# Altium schematic sheet MCU.SchDoc
size A4; SheetNumber: 2; SheetTotal: 6
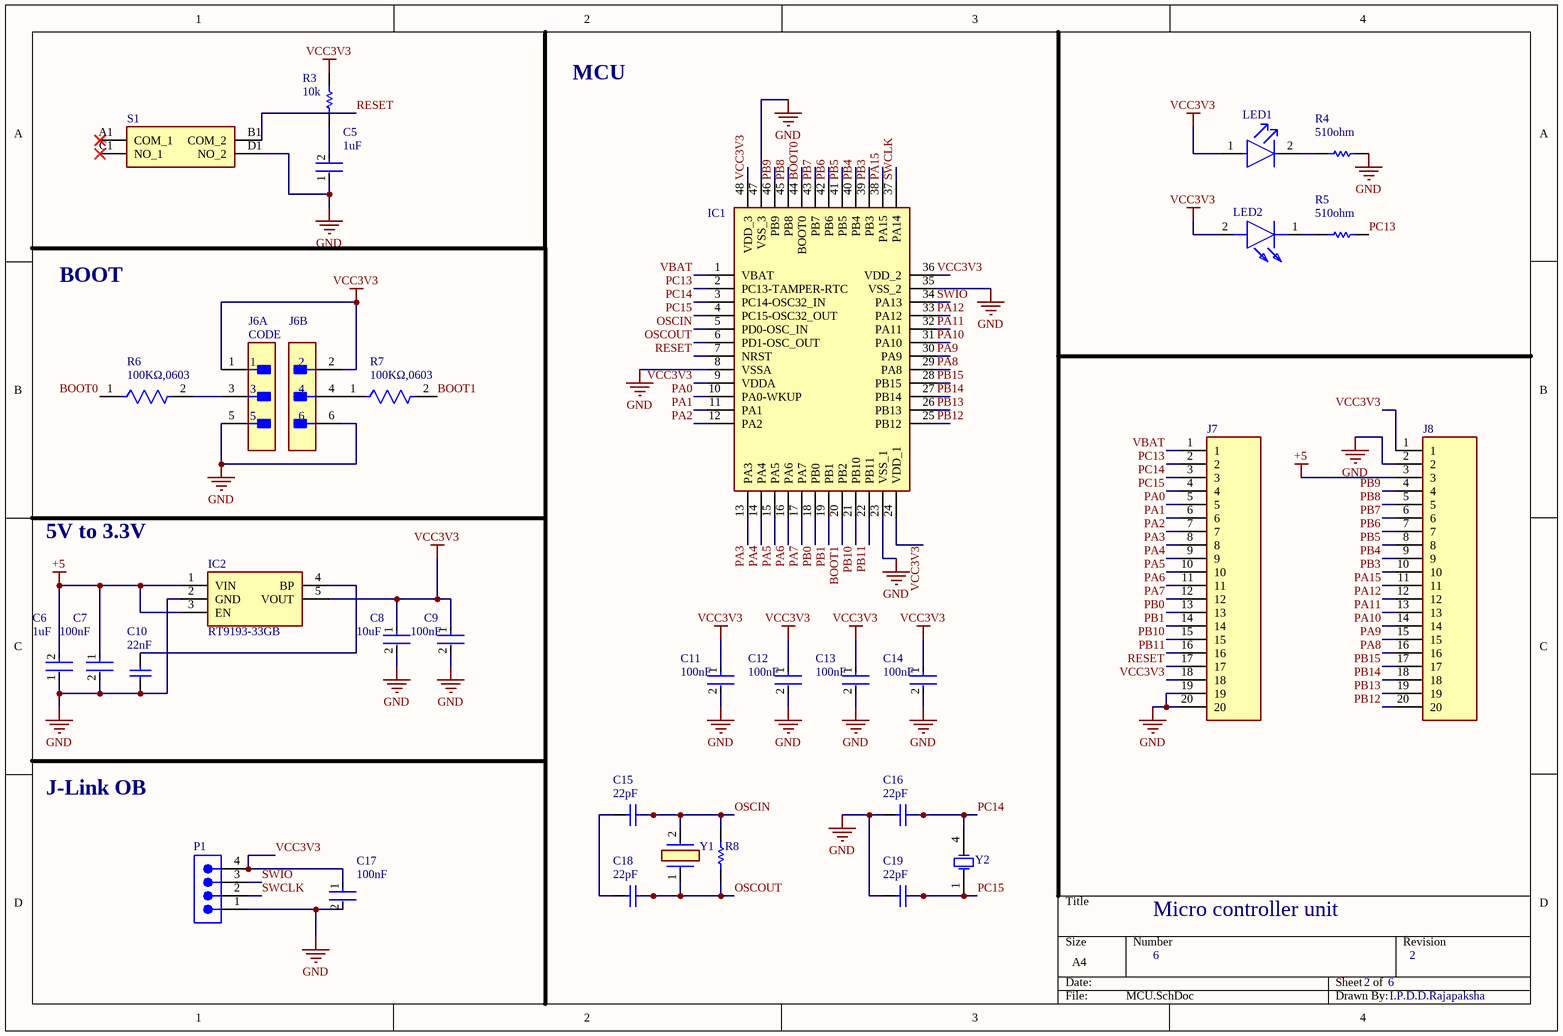
[diagram p0: MCU.SchDoc]

## Parts
C5  Capacitance: 1uF  [FP-C1608-080-0_1-IPC_A]  (hidden comment: C1608X6S1H105K080AC)
C6  Capacitance: 1uF  [FP-C1608-080-0_1-IPC_A]  (hidden comment: C1608X6S1H105K080AC)
C7  Capacitance: 100nF  [FP-C0603-030-0_03-IPC_C]  (hidden comment: C0603X5R1E104K030BB)
C8  value 10uF  [FP-CL05A106MP5NUNC-MFG]  (hidden comment: CL05A106MP5NUNC)
C9  Capacitance: 100nF  [FP-C0603-030-0_03-IPC_C]  (hidden comment: C0603X5R1E104K030BB)
C10  Parameter 1: 22nF  [CAPC1608X87X35ML15T15]  (hidden comment: C0603S223K5RACTU)
C11  Capacitance: 100nF  [FP-C0603-030-0_03-IPC_C]  (hidden comment: C0603X5R1E104K030BB)
C12  Capacitance: 100nF  [FP-C0603-030-0_03-IPC_C]  (hidden comment: C0603X5R1E104K030BB)
C13  Capacitance: 100nF  [FP-C0603-030-0_03-IPC_C]  (hidden comment: C0603X5R1E104K030BB)
C14  Capacitance: 100nF  [FP-C0603-030-0_03-IPC_C]  (hidden comment: C0603X5R1E104K030BB)
C15  Capacitance: 22pF  [CAPC1005X55X25ML05T05]  (hidden comment: CC0402JRNPO9BN220)
C16  Capacitance: 22pF  [CAPC1005X55X25ML05T05]  (hidden comment: CC0402JRNPO9BN220)
C17  Capacitance: 100nF  [FP-C0603-030-0_03-IPC_C]  (hidden comment: C0603X5R1E104K030BB)
C18  Capacitance: 22pF  [CAPC1005X55X25ML05T05]  (hidden comment: CC0402JRNPO9BN220)
C19  Capacitance: 22pF  [CAPC1005X55X25ML05T05]  (hidden comment: CC0402JRNPO9BN220)
IC1  STM32F103C8T6XXX  [QFP50P900X900X160-48N]  (value not drawn)
IC2  RT9193-33GB  [SOT94P279X130-5N]
J6  Parameter 1: CODE  [FP-90131-0763-MFG]  (hidden comment: 90131-0763)  (parts A,B of 2)
J7  TS-120-G-A-1  [HDRV20W64P0X254_1X20_5080X254X808P]  (value not drawn)
J8  TS-120-G-A-1  [HDRV20W64P0X254_1X20_5080X254X808P]  (value not drawn)
LED1  SM0805UBWC  [FP-SM0805UBWC-MFG]  (value not drawn)
LED2  SM0805RC  [LEDC2012X110N]  (value not drawn)
P1  61300411021  [61300411021]  (value not drawn)
R3  Parameter 1: 10k  [RESC1005X35X20ML05T10]  (hidden comment: CPF0402B30KE1)
R4  Parameter 1: 510ohm  [RESC1609X50X30NL10T20]  (hidden comment: CRCW0603510RFKEA)
R5  Parameter 1: 510ohm  [RESC1609X50X30NL10T20]  (hidden comment: CRCW0603510RFKEA)
R6  value 100KΩ,0603  [FP-SR0603-MFG]  (hidden comment: SR0603FR-7T100KL)
R7  value 100KΩ,0603  [FP-SR0603-MFG]  (hidden comment: SR0603FR-7T100KL)
R8  RK73B2ATTD105J  [RESC2013X60X30NL20T20]  (value not drawn)
S1  TS-1187A-B-A-B  [TS1187ABAB]  (value not drawn)
Y1  XT9S20ANA8M  [XT9S20ANA8M]  (value not drawn)
Y2  830003000  [WE-XTAL_85SMX]  (value not drawn)

## Nets
+5: C6.2 C7.1 IC2.1(VIN) IC2.3(EN) J8.3
GND: C5.1 C6.1 C7.2 C8.2 C9.2 C10.1 C11.2 C12.2 C13.2 C14.2 C16.1 C17.2 C19.1 IC1.8(VSSA) IC1.23(VSS_1) IC1.35(VSS_2) IC1.47(VSS_3) IC2.2(GND) J6.5 J6.6 J7.19 J7.20 J8.2 P1.1 R4.2 S1.D1(NO_2)
VCC3V3: C8.1 C9.1 C11.1 C12.1 C13.1 C14.1 C17.1 IC1.9(VDDA) IC1.24(VDD_1) IC1.36(VDD_2) IC1.48(VDD_3) IC2.5(VOUT) J6.1 J6.2 J7.18 J8.1 LED1.1(A) LED2.2(A) P1.4 R3.2
BOOT0: IC1.44(BOOT0) R6.1
BOOT1: IC1.20(PB2) R7.2
OSCIN: C15.2 IC1.5(PD0-OSC_IN) R8.2 Y1.2
OSCOUT: C18.2 IC1.6(PD1-OSC_OUT) R8.1 Y1.1
PA0: IC1.10(PA0-WKUP) J7.5
PA1: IC1.11(PA1) J7.6
PA2: IC1.12(PA2) J7.7
PA3: IC1.13(PA3) J7.8
PA4: IC1.14(PA4) J7.9
PA5: IC1.15(PA5) J7.10
PA6: IC1.16(PA6) J7.11
PA7: IC1.17(PA7) J7.12
PA8: IC1.29(PA8) J8.16
PA9: IC1.30(PA9) J8.15
PA10: IC1.31(PA10) J8.14
PA11: IC1.32(PA11) J8.13
PA12: IC1.33(PA12) J8.12
PA15: IC1.38(PA15) J8.11
PB0: IC1.18(PB0) J7.13
PB1: IC1.19(PB1) J7.14
PB3: IC1.39(PB3) J8.10
PB4: IC1.40(PB4) J8.9
PB5: IC1.41(PB5) J8.8
PB6: IC1.42(PB6) J8.7
PB7: IC1.43(PB7) J8.6
PB8: IC1.45(PB8) J8.5
PB9: IC1.46(PB9) J8.4
PB10: IC1.21(PB10) J7.15
PB11: IC1.22(PB11) J7.16
PB12: IC1.25(PB12) J8.20
PB13: IC1.26(PB13) J8.19
PB14: IC1.27(PB14) J8.18
PB15: IC1.28(PB15) J8.17
PC13: IC1.2(PC13-TAMPER-RTC) J7.2 R5.2
PC14: C16.2 IC1.3(PC14-OSC32_IN) J7.3 Y2.4(Crystal)
PC15: C19.2 IC1.4(PC15-OSC32_OUT) J7.4 Y2.1(Crystal)
RESET: IC1.7(NRST) J7.17 S1.B1(COM_2)
SWCLK: IC1.37(PA14) P1.2
SWIO: IC1.34(PA13) P1.3
VBAT: IC1.1(VBAT) J7.1
NetC5_2: C5.2 R3.1
NetC10_2: C10.2 IC2.4(BP)
NetC15_1: C15.1 C18.1
NetJ6_3: J6.3 R6.2
NetJ6_4: J6.4 R7.1
NetLED1_2: LED1.2(C) R4.1
NetLED2_1: LED2.1(K) R5.1

Not connected (* = marked no-connect by the designer): S1 A1(COM_1)* C1(NO_1)*

## Notes on the sheet
- MCU
- BOOT
- 5V to 3.3V
- J-Link OB
- Micro controller unit
- 6
- 2      6
- 2
- I.P.D.D.Rajapaksha

## Library data of the parts
C5 C6 = CMP-08246-003682-1: Multilayer Ceramic Capacitors 1μF ±10% 50V X6S SMD 0603; Dielectric: X6S; Series: C; Construction: Flat; REACH SVHC: No SVHC; Voltage Rating (DC): 50V; Dielectric Material: Ceramic; Weight: 7.1E-05oz; Case Code (Imperial): 0603; Width: 0.031inch; Voltage Rating: 50V; Min Operating Temperature: -55°C; Thickness: 0.035inch; Package Quantity: 4000; RoHS Compliant: Yes; Case/Package: 0603; Case Code (Metric): 1608; Packaging: Tape and Reel; Termination: SMD/SMT; Depth: 0.8mm; Tolerance: 10%; Height: 0.8mm; Max Operating Temperature: 105°C; Length: 1.6mm; Mount: Surface Mount; Lead Free: Lead Free
C7 C9 C11-C14 C17 = CMP-08246-005139-1: Multilayer Ceramic Capacitors 100nF ±10% 25V X5R SMD 0201; Min Operating Temperature: -55°C; Tolerance: 10%; Height: 0.3mm; Lead Free: Lead Free; Width: 0.012inch; Dielectric Material: Ceramic; Voltage Rating (DC): 25V; Voltage Rating: 25V; Thickness: 0.013inch; Depth: 0.3mm; Case Code (Imperial): 0201; Max Operating Temperature: 85°C; Case/Package: 0201; Series: C; RoHS Compliant: Yes; Packaging: Tape and Reel; Weight: 6E-06oz; Dielectric: X5R; Length: 0.6mm; Mount: Surface Mount; Case Code (Metric): 0603; Termination: SMD/SMT; REACH SVHC: No SVHC; Package Quantity: 15000
C8 = CMP-13271-000002-1: CAP CER 10UF 10V X5R 0402; Manufacturer: Samsung; Temperature Coefficient: 15%; Tolerance: 20%; Material: Ceramic; Octopart: https://octopart.com/cl05a106mp5nunc-samsung-22457395; Voltage Rating: 10V; RoHS: TRUE; Height: 0.7mm; Digikey Description: CAP CER 10UF 10V X5R 0402; Automotive: No; Package: CL05A106MP5NUNC; Device Class L1: Passive Components; Capacitance: 10uF; Temperature Range High: +85°C; ComponentLink2Description: Datasheet; Device Class L2: Capacitors; Temperature Characteristic: X5R; Manufacturer Part Number: CL05A106MP5NUNC; Temperature: -55°C to +85°C; ComponentLink2URL: http://www.samsungsem.com/kr/support/product-search/mlcc/__icsFiles/afieldfile/2019/05/10/19-CL05A106MP5NUNC.pdf; Device Class L3: Ceramic Capacitors; Category: Cap; Temperature Range Low: -55°C; Ipc Land Pattern Name: CAPC10050X50; Lead Free: Yes
C10 = CMP-2006-03290-1: Manufacturer: Kemet; Part Number: C0603S223K5RACTU
C15 C16 C18 C19 = CMP-2100-03590-1: Chip Capacitor, 22 pF, +/- 5%, 50 V, -55 to 125 degC, 0402 (1005 Metric), RoHS, Tape and Reel; Manufacturer: Yageo; Voltage Rating: 50V; Dielectric Material: Ceramic; Temperature Coefficient: 30ppm/degC; Dielectric: C0G; Insulation Resistance: 100GR; Datasheet URL: http://www.yageo.com/NewPortal/yageodocoutput?fileName=/pdf/MLCC/UPY-GP_NP0_16V-to-50V_14.pdf; Depth: 0.5mm; Number of Pins: 2; Height: 0.5mm; Min Operating Temperature: -55degC; REACH SVHC: NoSVHC; Max Operating Temperature: 125degC; Voltage Rating (DC): 50V; Composition: Ceramic; Packaging: TapeandReel; Package Quantity: 1; Package Reference: 0402; Length: 1mm; Radiation Hardening: No; Package Description: 2-Pin Surface Mount Device, Body 1 x 0.5 mm; RoHSCompliant: True; Thickness: 0.022inch; Manufacturer URL: http://www.yageo.com/; Mount: SurfaceMount; Case Code (Metric): 1005; Case/Package: 0402; Tolerance: 5%; Termination: SMD/SMT; Width: 0.02inch; Datasheet Version: Rev. 14, 07/2016; Lead Free: LeadFree; Case Code (Imperial): 0402
IC1 = STM32F103C8T6XXX: Integrated Circuit; Manufacturer_Name: ST; Height: 1.6mm; Manufacturer_Part_Number: STM32F103C8T6XXX
IC2 = RT9193-33GB: Integrated Circuit; Manufacturer_Name: RICHTEK; Datasheet Link: http://www.richtek.com/assets/product_file/RT9193/DS9193-17.pdf; Height: 1.295mm; Manufacturer_Part_Number: RT9193-33GB; Mouser Part Number: 835-RT9193-33GB; Mouser Price/Stock: https://www.mouser.co.uk/ProductDetail/Richtek/RT9193-33GB?qs=amGC7iS6iy8ybRcZ9Wn2ww%3D%3D
J6 = CMP-00257-00655468-1: 90131-0763 Conn Unshrouded Header HDR 6 POS 2.54mm Solder ST Top Entry Thru-Hole C-Grid III™ Tray; NexarPartId: 655468; Manufacturer Lifecycle Status: ACTIVE; Number of Poles: 6; Plating: Tin; Current Rating: 3A; Gender: Male; Voltage Rating (AC): 350V; Contact Resistance: 20mΩ; Insulation Resistance: 5GΩ; Pitch: 2.54mm; Height: 9.65mm; Mount: Through Hole; Termination: Through Hole; Contact Plating: Gold; Orientation: Vertical; Material: Glass, Polyester; Min Operating Temperature: -55°C; Lead Free: Lead Free; REACH SVHC: Unknown; Contact Material: Brass; Housing Color: Black; Schedule B: 8536694040; Number of Rows: 2; Lead Pitch: 2.54mm; Number of Circuits: 6; Number of Positions: 6; Lifecycle Status: Production; Max Operating Temperature: 125°C; Voltage Rating: 350V; Voltage Rating (DC): 350V; Country of Origin: SG; Housing Material: Polyester; RoHS: Compliant; Working Voltage: 350V; Number of Contacts: 6; Radiation Hardening: No
J7 J8 = TS-120-G-A-1: Connector; Manufacturer_Name: SAMTEC; Datasheet Link: https://componentsearchengine.com/Datasheets/2/TS-120-G-A-1.pdf; Height: 8.08mm; Manufacturer_Part_Number: TS-120-G-A-1; Mouser Part Number: 200-TS120GA1; Mouser Price/Stock: https://www.mouser.co.uk/ProductDetail/Samtec/TS-120-G-A-1?qs=0lQeLiL1qyYpomEmwQ8ssA%3D%3D; Arrow Part Number: TS-120-G-A-1; Arrow Price/Stock: https://www.arrow.com/en/products/ts-120-g-a-1/samtec?region=nac
LED1 = CMP-35283-000004-1: LED BLUE CLEAR 0805 SMD; Dominant Wavelength: 470nm; Forward Voltage: 3.3V; Forward Current: 20mA; Lens Color: Colorless; Lens Style: Rectangular; Luminous Intensity: 115mcd; Viewing Angle: 130°; Power Rating: 100mW; Lens Transparency: Clear; Height: 1.1mm; Mount: Surface Mount; Packaging: Tape and Reel; Package Quantity: 3000; Illumination Color: Blue; Width: 1.2mm; Min Operating Temperature: -30°C; Case Code (Imperial): 0805; Length: 2mm; Test Current: 20mA; Max Operating Temperature: 80°C; Case Code (Metric): 2012; Color: Blue; Wavelength: 470nm; Case/Package: 0805; Lead Free: Lead Free; Number of Pins: 2
LED2 = SM0805RC: LED; Manufacturer_Name: Bivar; Datasheet Link: https://componentsearchengine.com/Datasheets/1/SM0805RC.pdf; Height: 1.1mm; Manufacturer_Part_Number: SM0805RC; Mouser Part Number: 749-SM0805RC; Mouser Price/Stock: https://www.mouser.co.uk/ProductDetail/Bivar/SM0805RC?qs=jaLxTFIJCivm3JSYe5gHjQ%3D%3D
P1 = CMP-1502-01063-3: NexarPartId: 31153320; Current Rating: 3A; Number of Contacts: 4; Gender: Male; Operating Supply Voltage: 250V; Contact Resistance: 20mΩ; Connector Type: Male Pin; Pitch: 2.54mm; Contact Material: Copper; Number of Positions: 4; Color: Black; Contact Plating: Gold; Number of Pins: 4; Termination: Solder; Number of Rows: 1; Lead Pitch: 2.54mm; Mount: Through Hole; Contact Mating Length: 5.9944mm; RoHS: Compliant; REACH SVHC: Unknown
R3 = CMP-2002-03447-1: Manufacturer: TE Connectivity / AMP; Part Number: CPF0402B30KE1
R4 R5 = CMP-2000-03439-1: Manufacturer: Vishay Dale; Part Number: CRCW0603510RFKEA
R6 R7 = CMP-03412-000894-1: RES SMD 0603 1/4W 1% 100K OHM; Manufacturer: Yageo; Tolerance: 0.01; Voltage Rating: 75V; Power Rating: 0.25W; Resistance: 100KΩ; Automotive Grade: Grade 0; Ipc Land Pattern Name: RESC16080X45; Digikey Description: RES SMD 0603 1/4W 1% 100K OHM; Device Class L3: Chip SMD Resistors; Octopart: https://octopart.com/sr0603fr-7t100kl-yageo-91478071; Lead Free: Yes; RoHS: TRUE; Series: SR; Device Class L1: Passive Components; ComponentLink2URL: http://www.yageo.com/documents/recent/PYu-SR_D_F%20tol_RoHS_L_3.pdf; ComponentLink2Description: Datasheet; Automotive: Yes; Category: Res; Temperature Range High: +155°C; Manufacturer Part Number: SR0603FR-7T100KL; Height: 0.55mm; Composition: Thick Film; Temperature Range Low: -55°C; Footprint Url: http://www.yageo.com/exep/pages/download/literatures/PYu-R_Mount_10.pdf; Device Class L2: Resistors; Temperature: -55°C to +155°C; Package: SR0603
R8 = CMP-2001-04658-1: Manufacturer: KOA Speer; Part Number: RK73B2ATTD105J
S1 = TS-1187A-B-A-B: Switch; Manufacturer_Name: XKB Connectivity; Datasheet Link: http://www.helloxkb.com/public/images/pdf/TS-1187A-X-X-X.pdf; Height: 4.05mm; Manufacturer_Part_Number: TS-1187A-B-A-B
Y1 = XT9S20ANA8M: Crystal or Oscillator; Manufacturer_Name: Vishay; Datasheet Link: https://www.vishay.com/docs/35014/xt49s.pdf; Height: 3.5mm; Manufacturer_Part_Number: XT9S20ANA8M; Mouser Part Number: 73-XT49S800-20; Mouser Price/Stock: https://www.mouser.co.uk/ProductDetail/Vishay-Dale/XT9S20ANA8M?qs=oFi4%2FQsgZXYxL7wCZW5FzA%3D%3D; Arrow Part Number: XT9S20ANA8M; Arrow Price/Stock: https://www.arrow.com/en/products/xt9s20ana8m/vishay?region=nac
Y2 = CMP-03913-116855576-1: 830003000 WE-XTAL Quartz Crystal; Frequency: 32.768kHz; Min Operating Temperature: -40°C; Width: 3.7mm; NexarPartId: 116855576; Length: 8.7mm; Height: 2.5mm; Max Operating Temperature: 85°C